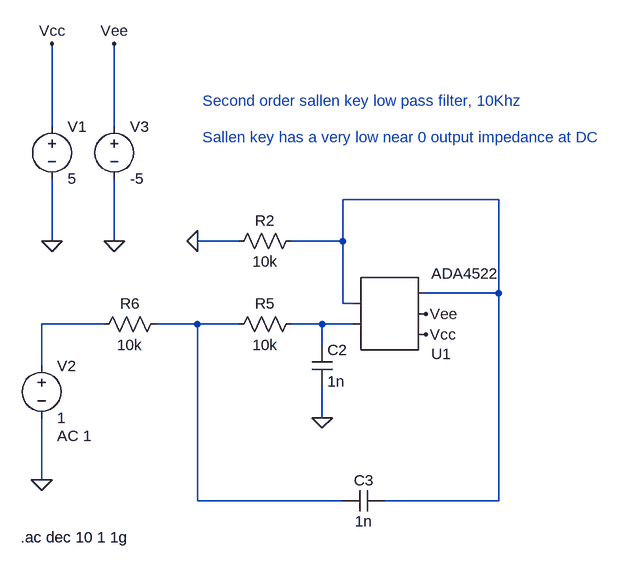
[diagram p0: schematic sallen_key.asc]
sallen_key.asc, the LTspice schematic file:
Version 4
SHEET 1 1256 680
WIRE -112 -256 -112 -384
WIRE -16 -256 -16 -384
WIRE 576 -144 336 -144
WIRE -112 -80 -112 -176
WIRE -16 -80 -16 -176
WIRE 176 -80 112 -80
WIRE 336 -80 336 -144
WIRE 336 -80 256 -80
WIRE 576 0 576 -144
WIRE 576 0 464 0
WIRE 336 16 336 -80
WIRE 352 16 336 16
WIRE -32 48 -128 48
WIRE 112 48 48 48
WIRE 176 48 112 48
WIRE 304 48 256 48
WIRE 352 48 304 48
WIRE 304 80 304 48
WIRE -128 112 -128 48
WIRE 304 192 304 144
WIRE -128 288 -128 192
WIRE 112 320 112 48
WIRE 336 320 112 320
WIRE 576 320 576 0
WIRE 576 320 400 320
FLAG 464 64 Vcc
FLAG 304 192 0
FLAG 112 -80 0
FLAG -112 -80 0
FLAG -112 -384 Vcc
FLAG -128 288 0
FLAG -16 -80 0
FLAG -16 -384 Vee
FLAG 464 32 Vee
SYMBOL res 272 32 R90
WINDOW 0 0 56 VBottom 2
WINDOW 3 32 56 VTop 2
SYMATTR InstName R5
SYMATTR Value 10k
SYMBOL res 64 32 R90
WINDOW 0 0 56 VBottom 2
WINDOW 3 32 56 VTop 2
SYMATTR InstName R6
SYMATTR Value 10k
SYMBOL cap 288 80 R0
SYMATTR InstName C2
SYMATTR Value 1n
SYMBOL cap 400 304 R90
WINDOW 0 0 32 VBottom 2
WINDOW 3 32 32 VTop 2
SYMATTR InstName C3
SYMATTR Value 1n
SYMBOL res 272 -96 R90
WINDOW 0 0 56 VBottom 2
WINDOW 3 32 56 VTop 2
SYMATTR InstName R2
SYMATTR Value 10k
SYMBOL voltage -112 -272 R0
WINDOW 123 0 0 Left 2
WINDOW 39 0 0 Left 2
SYMATTR InstName V1
SYMATTR Value 5
SYMBOL voltage -128 96 R0
WINDOW 123 24 124 Left 2
WINDOW 39 0 0 Left 2
SYMATTR Value2 AC 1
SYMATTR InstName V2
SYMATTR Value 1
SYMBOL voltage -16 -272 R0
WINDOW 123 0 0 Left 2
WINDOW 39 0 0 Left 2
SYMATTR InstName V3
SYMATTR Value -5
SYMBOL AutoGenerated\\ADA4522 416 32 M180
SYMATTR InstName U1
TEXT -160 376 Left 2 !.ac dec 10 1 1g
TEXT 120 -296 Left 2 ;Second order sallen key low pass filter, 10Khz
TEXT 120 -240 Left 2 ;Sallen key has a very low near 0 output impedance at DC

The netlist it stands for:
* sallen_key.asc
R5 N004 N003 10k
R6 N003 N002 10k
C2 N004 0 1n
C3 N001 N003 1n
R2 N001 0 10k
V1 Vcc 0 5
V2 N002 0 1 AC 1
V3 Vee 0 -5
* U1: ADA4522 (symbol AutoGenerated\ADA4522 not available, pins judged from their places): pin1=N004 pin2=N001 pin3=Vcc pin4=Vee pin5=N001
.ac dec 10 1 1g
* Second order sallen key low pass filter, 10Khz
* Sallen key has a very low near 0 output impedance at DC
.backanno
.end